# EAGLE design Baro_V3 (EAGLE 9.6.2)
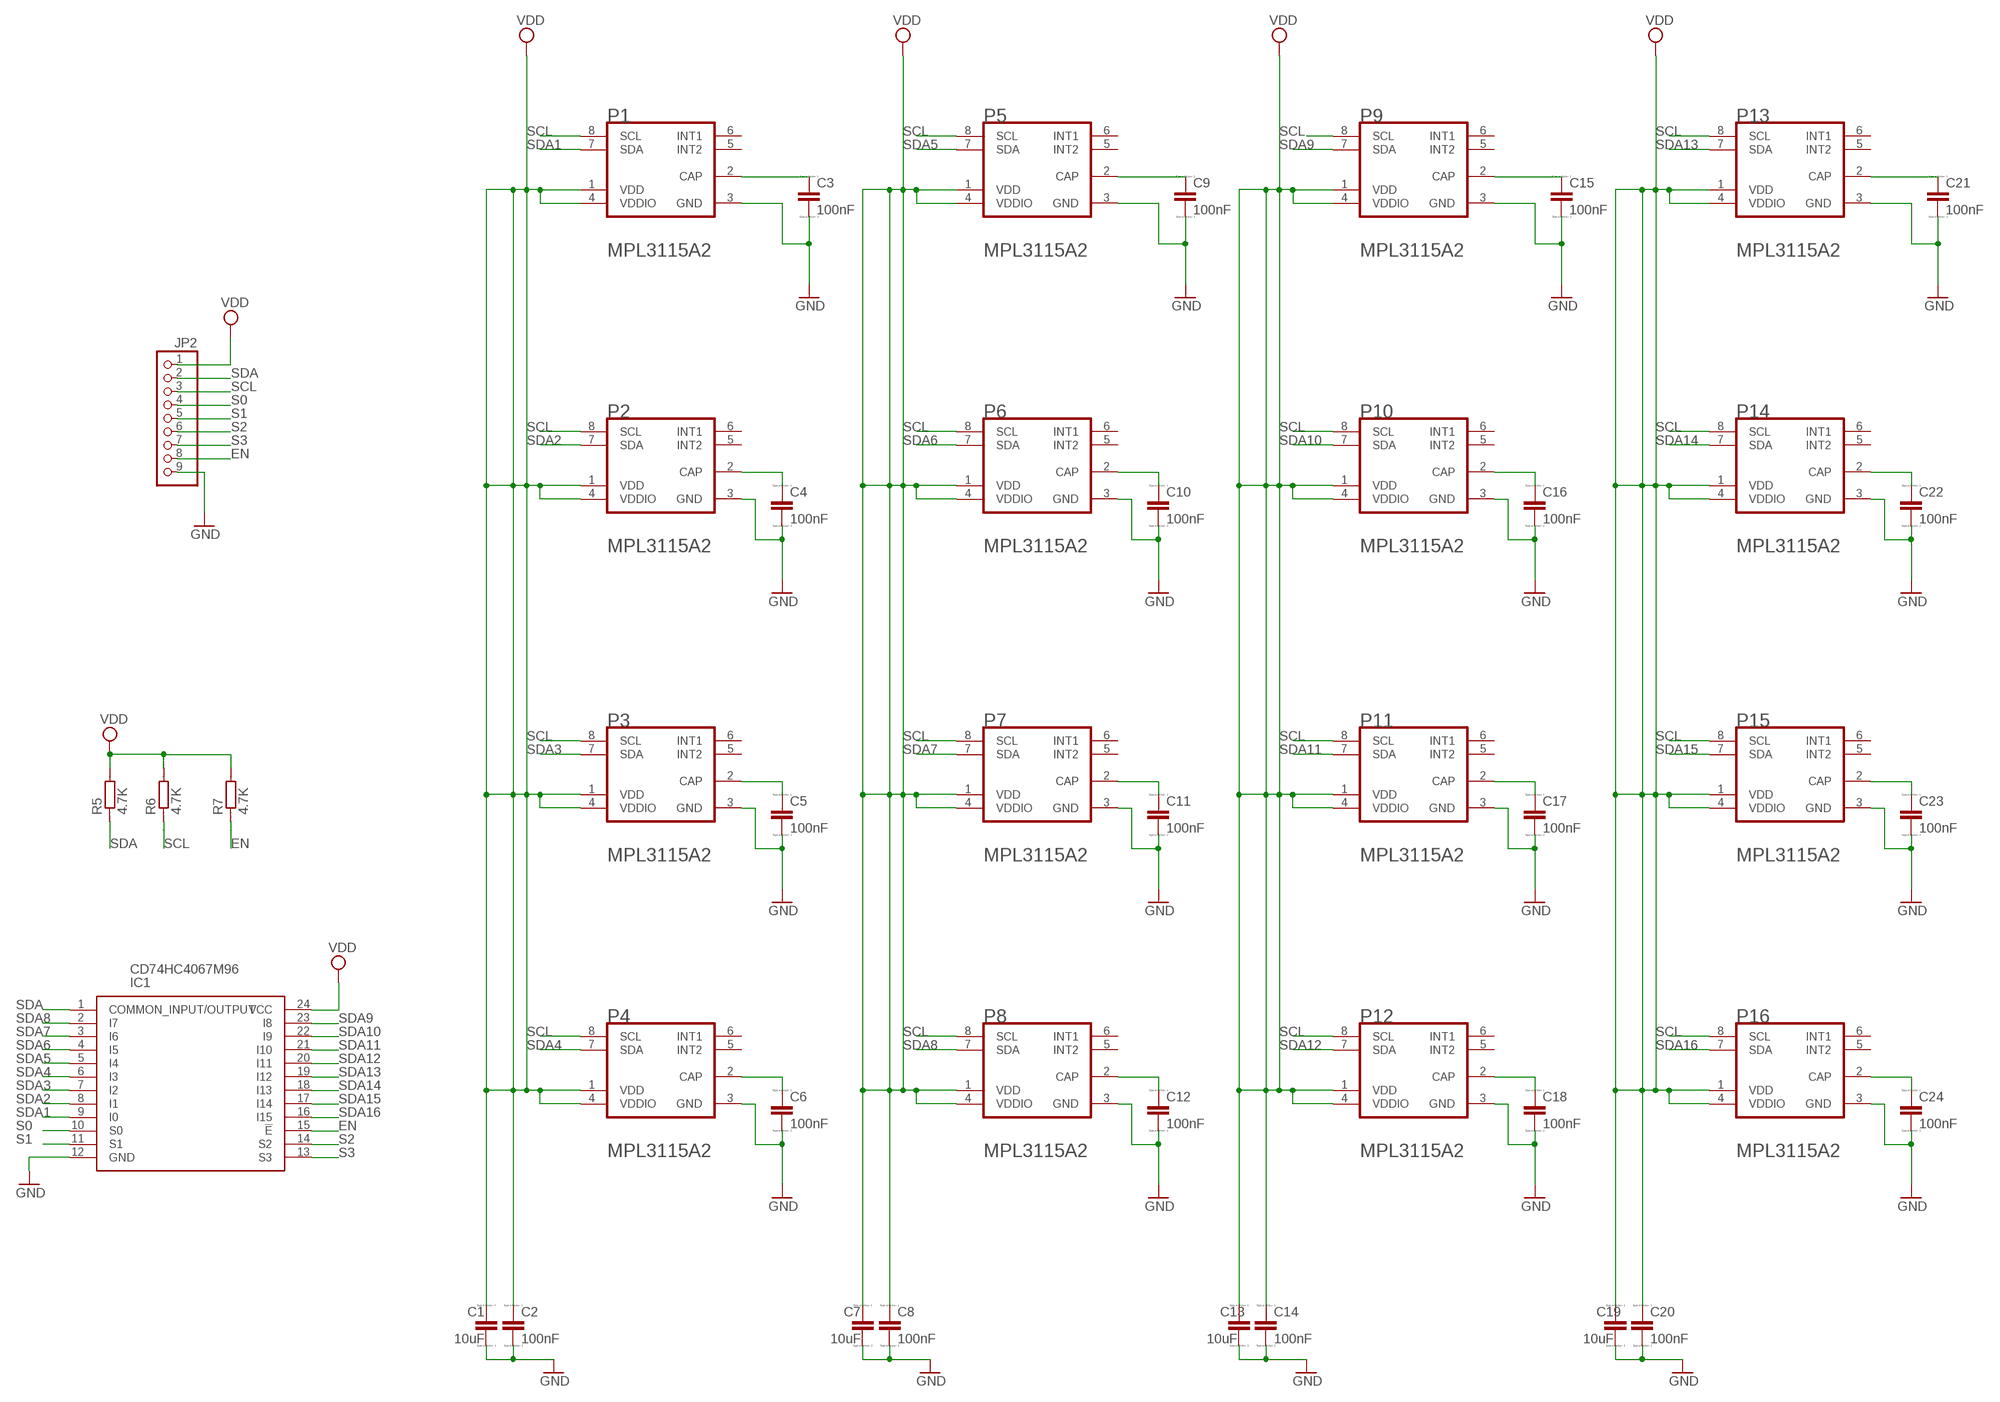
[diagram p0: schematic, sheet 1]

## Parts
C1  10uF  CC0603  [C0603]
C2  100nF  C  [C0805]
C3  100nF  C  [C0805]
C4  100nF  C  [C0805]
C5  100nF  C  [C0805]
C6  100nF  C  [C0805]
C7  10uF  CC0603  [C0603]
C8  100nF  C  [C0805]
C9  100nF  C  [C0805]
C10  100nF  C  [C0805]
C11  100nF  C  [C0805]
C12  100nF  C  [C0805]
C13  10uF  CC0603  [C0603]
C14  100nF  C  [C0805]
C15  100nF  C  [C0805]
C16  100nF  C  [C0805]
C17  100nF  C  [C0805]
C18  100nF  C  [C0805]
C19  10uF  CC0603  [C0603]
C20  100nF  C  [C0805]
C21  100nF  C  [C0805]
C22  100nF  C  [C0805]
C23  100nF  C  [C0805]
C24  100nF  C  [C0805]
IC1  CD74HC4067M96  [SOIC127P1030X265-24N]
JP2  PINHD-1X9  [1X09]
P1  FREESCALE_SEMICONDUCTOR_MPL3115A2FREESCALE_SEMICONDUCTOR_MPL3115A2_0_0  [FREESCALE_SEMICONDUCTOR_MPL3115A2_0]
P2  FREESCALE_SEMICONDUCTOR_MPL3115A2FREESCALE_SEMICONDUCTOR_MPL3115A2_0_0  [FREESCALE_SEMICONDUCTOR_MPL3115A2_0]
P3  FREESCALE_SEMICONDUCTOR_MPL3115A2FREESCALE_SEMICONDUCTOR_MPL3115A2_0_0  [FREESCALE_SEMICONDUCTOR_MPL3115A2_0]
P4  FREESCALE_SEMICONDUCTOR_MPL3115A2FREESCALE_SEMICONDUCTOR_MPL3115A2_0_0  [FREESCALE_SEMICONDUCTOR_MPL3115A2_0]
P5  FREESCALE_SEMICONDUCTOR_MPL3115A2FREESCALE_SEMICONDUCTOR_MPL3115A2_0_0  [FREESCALE_SEMICONDUCTOR_MPL3115A2_0]
P6  FREESCALE_SEMICONDUCTOR_MPL3115A2FREESCALE_SEMICONDUCTOR_MPL3115A2_0_0  [FREESCALE_SEMICONDUCTOR_MPL3115A2_0]
P7  FREESCALE_SEMICONDUCTOR_MPL3115A2FREESCALE_SEMICONDUCTOR_MPL3115A2_0_0  [FREESCALE_SEMICONDUCTOR_MPL3115A2_0]
P8  FREESCALE_SEMICONDUCTOR_MPL3115A2FREESCALE_SEMICONDUCTOR_MPL3115A2_0_0  [FREESCALE_SEMICONDUCTOR_MPL3115A2_0]
P9  FREESCALE_SEMICONDUCTOR_MPL3115A2FREESCALE_SEMICONDUCTOR_MPL3115A2_0_0  [FREESCALE_SEMICONDUCTOR_MPL3115A2_0]
P10  FREESCALE_SEMICONDUCTOR_MPL3115A2FREESCALE_SEMICONDUCTOR_MPL3115A2_0_0  [FREESCALE_SEMICONDUCTOR_MPL3115A2_0]
P11  FREESCALE_SEMICONDUCTOR_MPL3115A2FREESCALE_SEMICONDUCTOR_MPL3115A2_0_0  [FREESCALE_SEMICONDUCTOR_MPL3115A2_0]
P12  FREESCALE_SEMICONDUCTOR_MPL3115A2FREESCALE_SEMICONDUCTOR_MPL3115A2_0_0  [FREESCALE_SEMICONDUCTOR_MPL3115A2_0]
P13  FREESCALE_SEMICONDUCTOR_MPL3115A2FREESCALE_SEMICONDUCTOR_MPL3115A2_0_0  [FREESCALE_SEMICONDUCTOR_MPL3115A2_0]
P14  FREESCALE_SEMICONDUCTOR_MPL3115A2FREESCALE_SEMICONDUCTOR_MPL3115A2_0_0  [FREESCALE_SEMICONDUCTOR_MPL3115A2_0]
P15  FREESCALE_SEMICONDUCTOR_MPL3115A2FREESCALE_SEMICONDUCTOR_MPL3115A2_0_0  [FREESCALE_SEMICONDUCTOR_MPL3115A2_0]
P16  FREESCALE_SEMICONDUCTOR_MPL3115A2FREESCALE_SEMICONDUCTOR_MPL3115A2_0_0  [FREESCALE_SEMICONDUCTOR_MPL3115A2_0]
R5  4.7K  RR0603  [R0603]
R6  4.7K  RR0603  [R0603]
R7  4.7K  RR0603  [R0603]

## Nets
EN [EN]: IC1.15(!E) JP2.8 R7.1
GND: C1.2 C2.2 C3.2 C4.2 C5.2 C6.2 C7.2 C8.2 C9.2 C10.2 C11.2 C12.2 C13.2 C14.2 C15.2 C16.2 C17.2 C18.2 C19.2 C20.2 C21.2 C22.2 C23.2 C24.2 IC1.12(GND) JP2.9 P1.3(GND) P2.3(GND) P3.3(GND) P4.3(GND) P5.3(GND) P6.3(GND) P7.3(GND) P8.3(GND) P9.3(GND) P10.3(GND) P11.3(GND) P12.3(GND) P13.3(GND) P14.3(GND) P15.3(GND) P16.3(GND)
N$3: C3.1 P1.2(CAP)
N$6: C4.1 P2.2(CAP)
N$7: C9.1 P5.2(CAP)
N$9: C10.1 P6.2(CAP)
N$11: C11.1 P7.2(CAP)
N$13: C12.1 P8.2(CAP)
N$14: C5.1 P3.2(CAP)
N$15: C6.1 P4.2(CAP)
N$21: C15.1 P9.2(CAP)
N$30: C16.1 P10.2(CAP)
N$31: C17.1 P11.2(CAP)
N$32: C18.1 P12.2(CAP)
N$45: C21.1 P13.2(CAP)
N$46: C22.1 P14.2(CAP)
N$47: C23.1 P15.2(CAP)
N$48: C24.1 P16.2(CAP)
S0 [S0]: IC1.10(S0) JP2.4
S1 [S1]: IC1.11(S1) JP2.5
S2 [S2]: IC1.14(S2) JP2.6
S3 [S3]: IC1.13(S3) JP2.7
SCL [SCL]: JP2.3 P1.8(SCL) P2.8(SCL) P3.8(SCL) P4.8(SCL) P5.8(SCL) P6.8(SCL) P7.8(SCL) P8.8(SCL) P9.8(SCL) P10.8(SCL) P11.8(SCL) P12.8(SCL) P13.8(SCL) P14.8(SCL) P15.8(SCL) P16.8(SCL) R6.1
SDA [SDA]: IC1.1(COMMON_INPUT/OUTPUT) JP2.2 R5.1
SDA1: IC1.9(I0) P1.7(SDA)
SDA2: IC1.8(I1) P2.7(SDA)
SDA3: IC1.7(I2) P3.7(SDA)
SDA4: IC1.6(I3) P4.7(SDA)
SDA5: IC1.5(I4) P5.7(SDA)
SDA6: IC1.4(I5) P6.7(SDA)
SDA7: IC1.3(I6) P7.7(SDA)
SDA8: IC1.2(I7) P8.7(SDA)
SDA9: IC1.23(I8) P9.7(SDA)
SDA10: IC1.22(I9) P10.7(SDA)
SDA11: IC1.21(I10) P11.7(SDA)
SDA12: IC1.20(I11) P12.7(SDA)
SDA13: IC1.19(I12) P13.7(SDA)
SDA14: IC1.18(I13) P14.7(SDA)
SDA15: IC1.17(I14) P15.7(SDA)
SDA16: IC1.16(I15) P16.7(SDA)
VDD: C1.1 C2.1 C7.1 C8.1 C13.1 C14.1 C19.1 C20.1 IC1.24(VCC) JP2.1 P1.1(VDD) P1.4(VDDIO) P2.1(VDD) P2.4(VDDIO) P3.1(VDD) P3.4(VDDIO) P4.1(VDD) P4.4(VDDIO) P5.1(VDD) P5.4(VDDIO) P6.1(VDD) P6.4(VDDIO) P7.1(VDD) P7.4(VDDIO) P8.1(VDD) P8.4(VDDIO) P9.1(VDD) P9.4(VDDIO) P10.1(VDD) P10.4(VDDIO) P11.1(VDD) P11.4(VDDIO) P12.1(VDD) P12.4(VDDIO) P13.1(VDD) P13.4(VDDIO) P14.1(VDD) P14.4(VDDIO) P15.1(VDD) P15.4(VDDIO) P16.1(VDD) P16.4(VDDIO) R5.2 R6.2 R7.2
Unconnected: P1.5(INT2) P1.6(INT1) P2.5(INT2) P2.6(INT1) P3.5(INT2) P3.6(INT1) P4.5(INT2) P4.6(INT1) P5.5(INT2) P5.6(INT1) P6.5(INT2) P6.6(INT1) P7.5(INT2) P7.6(INT1) P8.5(INT2) P8.6(INT1) P9.5(INT2) P9.6(INT1) P10.5(INT2) P10.6(INT1) P11.5(INT2) P11.6(INT1) P12.5(INT2) P12.6(INT1) P13.5(INT2) P13.6(INT1) P14.5(INT2) P14.6(INT1) P15.5(INT2) P15.6(INT1) P16.5(INT2) P16.6(INT1)

## Library data of the parts
C1-C24 = eagle-ltspice:C: CAPACITOR, European symbol; SPICEMODEL: NONE; SPICEPREFIX: C
IC1 = CD74HC4067M96:CD74HC4067M96: High Speed CMOS 16-Channel Analog Multiplexer/Demultiplexer Source: Datasheet <http://www.ti.com/lit/gpn/cd74hc4067>; DESCRIPTION: High Speed CMOS 16-Channel Analog Multiplexer/Demultiplexer; HEIGHT: 2.65mm; MANUFACTURER_NAME: Texas Instruments; MANUFACTURER_PART_NUMBER: CD74HC4067M96; MOUSER_PART_NUMBER: 595-CD74HC4067M96; MOUSER_PRICE-STOCK: https://www.mouser.co.uk/ProductDetail/Texas-Instruments/CD74HC4067M96?qs=xFfolx0DHx0XT7d9xTTZBA%3D%3D
JP2 = pinhead:PINHD-1X9: PIN HEADER
P1-P16 = Freescale Semiconductor - MPL3115A2:FREESCALE_SEMICONDUCTOR_MPL3115A2: FRES-MPL3115A2-8; CIIVA_IDS: 1172243; COMPONENT_LINK_1_DESCRIPTION: Manufacturer URL; COMPONENT_LINK_1_URL: http://www.freescale.com/; COMPONENT_LINK_3_DESCRIPTION: Package Specification; COMPONENT_LINK_3_URL: http://cache.freescale.com/files/shared/doc/package_info/98ASA00260D.pdf; DATASHEET: http://cache.freescale.com/files/sensors/doc/data_sheet/MPL3115A2.pdf; DATASHEET_VERSION: Rev. 3.0; FOOTPRINT_VARIANT_NAME_0: Manufacturer Recommended; FSCL20_PF: 4 MHz Max.; FSCL400_PF: 400 KHz Max.; IMPORTED: yes; IMPORTED_FROM: vault; IMPORT_TS: 1521845373; MF: Freescale Semiconductor; MOUNTING_TECHNOLOGY: Surface Mount; MPN: MPL3115A2; OPERATING_TEMPERATURE_RANGE: -40 to 85 degC; PACKAGE_DESCRIPTION: 8-Pin Land Grid Array, Body 5 x 3 mm, Pitch 1.25 mm; PACKAGE_VERSION: Rev. O; PACKING: Tray; PIN_0_0_7_INSIDE_EDGE: clock; PREFIX: U; RELEASE_DATE: 1435138815; ROHS: Yes; VAULT_GUID: C9CA789F-172F-4FBE-A7EA-5C936E43DE32; VAULT_REVISION: 13F1D4E8-B129-4F1C-B772-6A98733F3276; VDD: 1.95 to 3.6 V; VDDIO: 1.62 to 3.6 V
R5-R7 = eagle-ltspice:R: RESISTOR, European symbol; SPICEMODEL: NONE; SPICEPREFIX: R

## Board
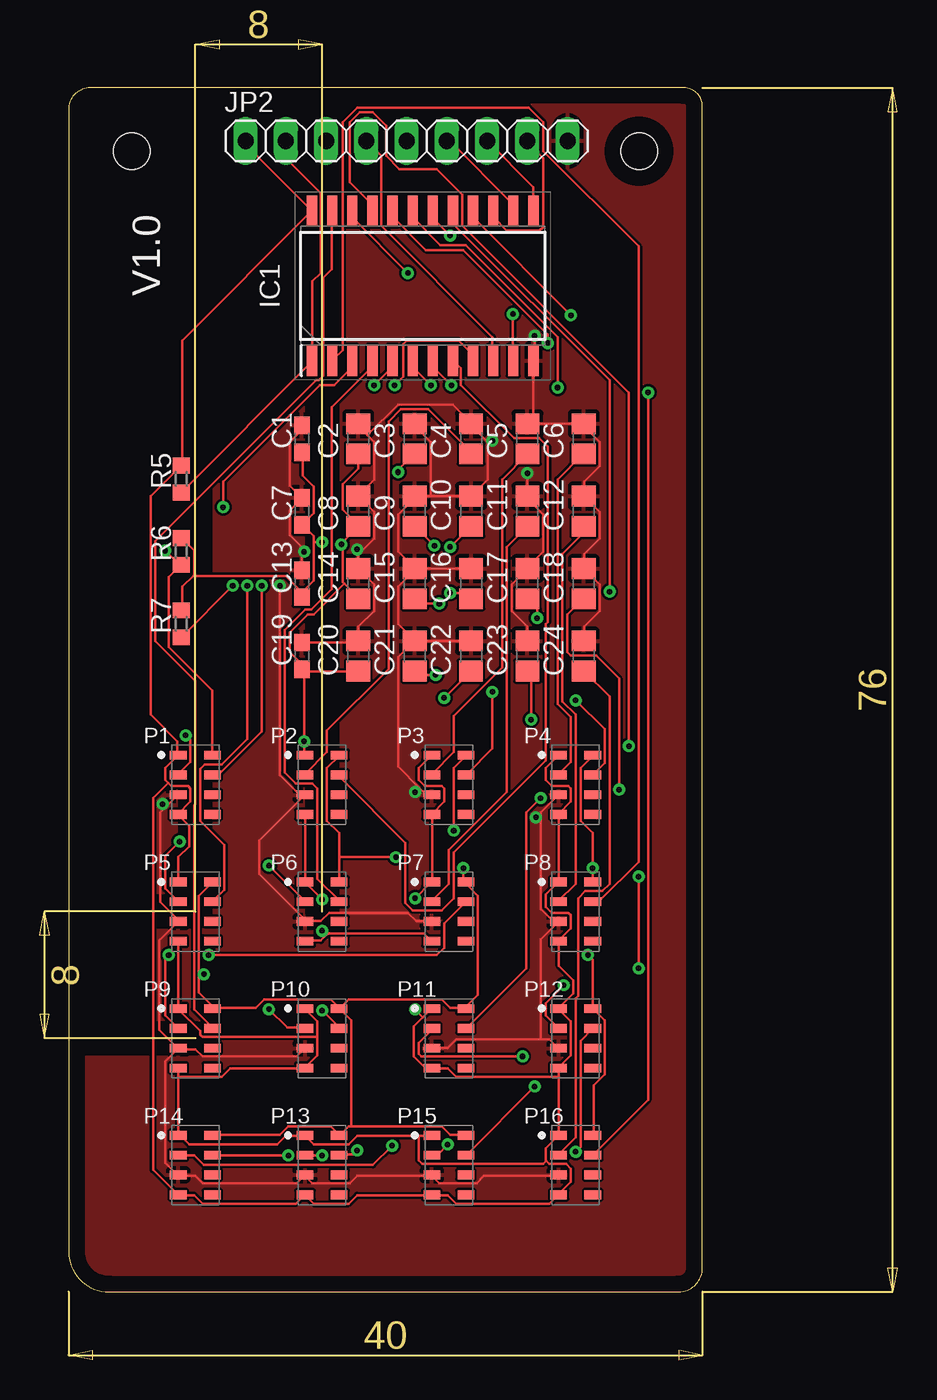
[diagram p1: board, top side]
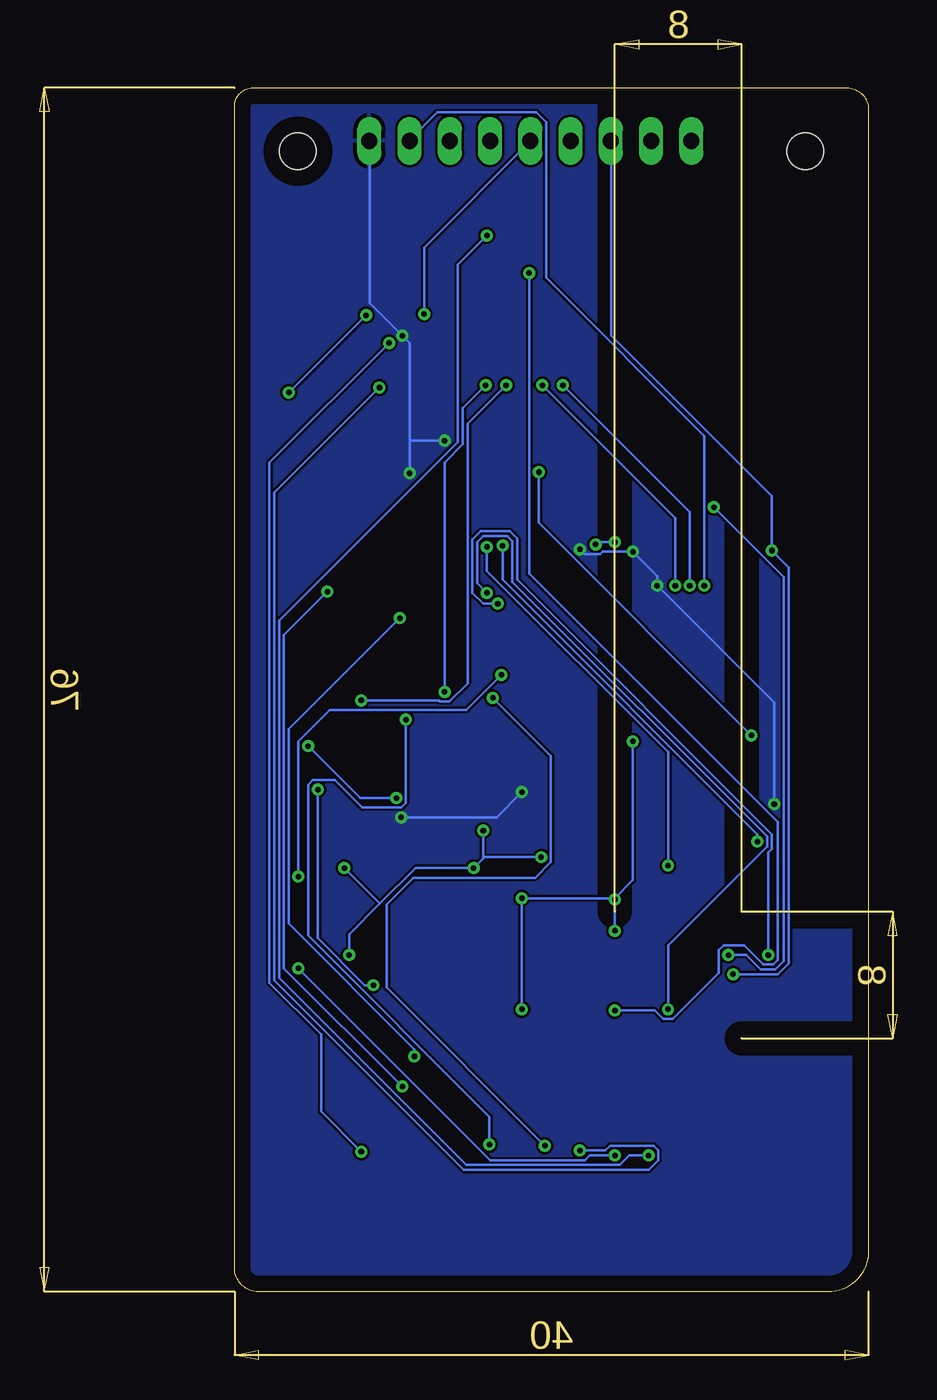
[diagram p2: board, bottom side, seen from below]

Size 40 x 76 mm. Coordinates in mm from the lower left corner, seen from the top.
Outline: 0,74.62 0,2.54 arc90 2.54,0 38.5,0 arc90 40,1.5 40,74.83 arc90 38.84,76 1.38,76 arc90 0,74.62
Copper layers (1*16): Top 0.035mm / dielectric 1.5mm / Bottom 0.035mm
Design rules "default": minimum track width 6mil, minimum drill 0.35mm, track to track 6mil, track to pad 6mil, pad to pad 6mil, via to via 6mil, smd to smd 6mil, copper to edge 40mil, drill to drill 6mil, minimum pad ring 10mil, minimum via ring 8mil, stop-mask expansion 4mil, vias tented up to drill 0mil, thermal gap 10mil
Holes 2.3 mm at 36,72 4,72

### Footprints (pad centres in the part's own frame; a part is rotated, then mirrored left to right if it is on the bottom)
C0603 = smd 1.1 x 1: 1 -0.85,0; 2 0.85,0
C0805 = smd 1.3 x 1.5: 1 -0.95,0; 2 0.95,0
SOIC127P1030X265-24N = smd 1.95 x 0.65: 1 -4.725,6.985; 2 -4.725,5.715; 3 -4.725,4.445; 4 -4.725,3.175; 5 -4.725,1.905; 6 -4.725,0.635; 7 -4.725,-0.635; 8 -4.725,-1.905; 9 -4.725,-3.175; 10 -4.725,-4.445; 11 -4.725,-5.715; 12 -4.725,-6.985; 13 4.725,-6.985; 14 4.725,-5.715; 15 4.725,-4.445; 16 4.725,-3.175; 17 4.725,-1.905; 18 4.725,-0.635; 19 4.725,0.635; 20 4.725,1.905; 21 4.725,3.175; 22 4.725,4.445; 23 4.725,5.715; 24 4.725,6.985
1X09 = drill 1.016 long: 1 -10.16,0; 2 -7.62,0; 3 -5.08,0; 4 -2.54,0; 5 0,0; 6 2.54,0; 7 5.08,0; 8 7.62,0; 9 10.16,0
FREESCALE_SEMICONDUCTOR_MPL3115A2_0 = smd 1.05 x 0.55: 1 -1.075,1.875; 2 -1.075,0.625; 3 -1.075,-0.625; 4 -1.075,-1.875; 5 1.075,-1.875; 6 1.075,-0.625; 7 1.075,0.625; 8 1.075,1.875
R0603 = smd 1 x 1.1: 1 -0.85,0; 2 0.85,0

### Placement (x,y rotation side)
C1  14.73,53.85 90 top
C2  18.29,53.85 90 top
C3  21.84,53.85 90 top
C4  25.4,53.85 90 top
C5  28.96,53.85 90 top
C6  32.51,53.85 90 top
C7  14.73,49.28 90 top
C8  18.29,49.28 90 top
C9  21.84,49.28 90 top
C10  25.4,49.28 90 top
C11  28.96,49.28 90 top
C12  32.51,49.28 90 top
C13  14.73,44.7 90 top
C14  18.29,44.7 90 top
C15  21.84,44.7 90 top
C16  25.4,44.7 90 top
C17  28.96,44.7 90 top
C18  32.51,44.7 90 top
C19  14.73,40.13 90 top
C20  18.29,40.13 90 top
C21  21.84,40.13 90 top
C22  25.4,40.13 90 top
C23  28.96,40.13 90 top
C24  32.51,40.13 90 top
IC1  22.35,63.5 90 top
JP2  21.34,72.64 0 top
P1  8,32 0 top
P2  16,32 0 top
P3  24,32 0 top
P4  32,32 0 top
P5  8,24 0 top
P6  16,24 0 top
P7  24,24 0 top
P8  32,24 0 top
P9  8,16 0 top
P10  16,16 0 top
P11  24,16 0 top
P12  32,16 0 top
P13  16,8 0 top
P14  8,8 0 top
P15  24,8 0 top
P16  32,8 0 top
R5  7.11,51.31 90 top
R6  7.11,46.74 90 top
R7  7.11,42.16 90 top

### Tracks (layer width: path | path; a pad name or v marks a point on that pad's centre or on a via)
EN  (via drill 0.35)
  Top 0.152: v10.36,44.58 7.16,41.38 R7.1 | JP2.8 28.96,72.54 29.95,71.55 29.95,67.21 29.72,66.98 27.66,66.98 26.82,67.82 26.82,68.2 IC1.15
  Bottom 0.152: v10.36,44.58 10.36,54.03 20.34,64.01 20.34,73.84 20.95,74.45 27.2,74.45 28.96,72.69 JP2.8
GND  (via drill 0.35)
  Top 0.152: 6.13,30.59 6.86,31.32 P1.3 | 6.13,30.59 5.79,30.25 5.79,24.61 6.86,23.55 6.86,23.39 P5.3 6.86,23.32 5.71,22.17 5.71,16.54 6.86,15.39 P9.3 | P9.3 6.93,15.32 8,15.32 8.46,14.86 14.4,14.86 14.86,15.32 P10.3 | P16.3 30.86,7.32 26.21,7.32 25.76,6.86 23.39,6.86 22.94,7.32 P15.3 22.86,7.32 18.21,7.32 17.75,6.86 15.39,6.86 14.94,7.32 P13.3 14.86,7.32 14.4,6.86 8.46,6.86 8,7.32 6.93,7.32 P14.3 6.86,7.39 6.1,8.15 6.1,14.55 6.86,15.32 P9.3 | P7.3 22.86,23.39 21.95,23.39 21.41,23.93 16.46,23.93 15.93,23.39 14.94,23.39 P6.3 14.94,23.47 12.04,26.36 12.04,28.5 14.86,31.32 P2.3 14.71,31.24 13.34,32.61 v13.34,44.58 | 14.71,46.71 14.71,47.02 13.95,47.78 13.95,49.3 14.71,50.06 C7.2 14.71,50.14 13.95,50.9 13.95,53.65 14.71,54.41 14.71,54.63 C1.2 | 14.71,46.71 14.71,45.57 C13.2 | C19.2 14.78,41 18.21,41 C20.2 18.29,41.99 19.28,42.98 19.28,44.65 C14.2 18.29,46.56 18.4,46.67 | 18.4,46.67 19.28,47.55 19.28,49.23 18.29,50.22 C8.2 18.29,50.29 19.28,51.28 19.28,53.65 18.86,54.06 | C2.2 18.29,54.63 18.86,54.06 | v14.86,46.71 14.71,46.71 | 18.4,46.67 v18.21,46.86 | C23.2 28.96,41.99 27.96,42.98 27.96,44.65 C17.2 28.96,45.72 29.95,46.71 29.95,49.07 28.96,50.06 C11.2 v28.96,51.66 | C24.2 32.54,41.15 32.54,41.99 33.53,42.98 33.53,44.65 32.54,45.64 C18.2 32.54,45.72 32.54,46.56 33.53,47.55 33.53,49.23 32.54,50.22 C12.2 32.54,50.29 32.54,51.13 33.53,52.12 33.53,53.65 32.46,54.71 C6.2 32.46,54.79 29.34,54.79 | 29.34,54.79 28.96,54.79 C5.2 29.34,54.79 | 29.34,54.79 IC1.12 29.34,58.83 29.41,58.9 v29.41,60.35 | 29.79,15.93 30.33,15.93 30.86,15.39 P12.3 | 29.79,15.93 24.46,15.93 23.93,15.39 22.94,15.39 P11.3
  Top 0.152: 29.79,15.93 29.79,22.25 30.86,23.32 P8.3 30.71,23.24 29.79,24.16 29.79,29.95 | 29.79,29.95 29.79,30.25 30.86,31.32 P4.3 | 22.86,50.22 25.38,50.22 C10.2 25.45,50.29 26.44,51.28 26.44,53.65 26.4,53.68 | 22.86,50.22 21.87,50.22 C9.2 21.87,50.14 20.8,49.07 20.8,46.71 21.79,45.72 C15.2 | 22.86,50.22 22.86,53.65 21.87,54.63 21.87,54.79 C3.2 | 26.4,53.68 25.45,54.63 25.45,54.79 C4.2 25.38,54.86 24.23,56.01 20.8,56.01 18.86,54.06 | C15.2 21.87,45.64 25.38,45.64 C16.2 | 22.14,31.81 20.8,33.15 20.8,40.08 21.79,41.07 C21.2 | 22.14,31.81 22.55,31.39 22.86,31.39 P3.3 | C22.2 25.38,41.07 21.87,41.07 C21.2 | C15.2 21.87,45.57 20.8,44.5 20.8,42.14 21.79,41.15 C21.2 | v29.49,29.95 29.79,29.95 | 22.14,31.81 v21.87,31.55 | v26.75,53.72 26.44,53.72 26.4,53.68 | v5.94,30.79 6.13,30.59
  Bottom 0.152: v18.21,46.86 17.91,46.56 16.92,46.56 16.76,46.71 v14.86,46.71 13.34,45.19 v13.34,44.58 5.94,37.19 v5.94,30.79 | JP2.9 31.47,72.62 31.47,62.41 v29.41,60.35 28.96,59.89 28.96,53.72 | 28.96,53.72 v28.96,51.66 | v29.49,29.95 23.47,29.95 v21.87,31.55 | v26.75,53.72 28.96,53.72
  pour Bottom: 0,75.18 1.02,76.2 39.12,76.2 40.13,75.18 40.13,73.15 40.13,1.02 39.12,0 1.52,0 1.02,0 0,1.02
  pour Top: 0,75.18 1.02,76.2 39.62,76.2 40.13,75.69 40.13,71.12 40.13,1.02 39.12,0 1.52,0 0,1.52
N$3  (via drill 0.35)
  Top 0.152: v7.39,35.13 7.7,34.82 7.7,33.45 6.93,32.69 P1.2 | v20.8,51.74 20.8,51.89 21.79,52.88 C3.1
  Bottom 0.152: v7.39,35.13 20.8,48.54 v20.8,51.74
N$6
  Top 0.152: P2.2 14.94,32.69 16.31,34.06 16.31,35.43 20.19,39.32 20.19,54.94 20.95,55.7 22.71,55.7 25.45,52.96 C4.1
N$7  (via drill 0.35)
  Top 0.152: v7.01,28.42 6.1,27.51 6.1,25.45 6.86,24.69 P5.2 | v23.09,47.09 21.87,48.31 C9.1
  Bottom 0.152: v7.01,28.42 7.01,28.88 23.09,44.96 v23.09,47.09
N$9  (via drill 0.35)
  Top 0.152: v12.65,26.9 14.86,24.69 P6.2 | v24.08,47.02 25.38,48.31 C10.1
  Bottom 0.152: v12.65,26.9 12.65,34.06 24.08,45.49 v24.08,47.02
N$11
  Top 0.152: P7.2 22.94,24.69 24,25.76 24,27.89 27.66,31.55 27.66,47.02 28.96,48.31 C11.1
N$13
  Top 0.152: P8.2 30.94,24.69 32,25.76 32,36.42 31.17,37.26 31.17,46.56 32.46,47.85 32.46,48.31 C12.1
N$14
  Top 0.152: P3.2 22.94,32.69 24.31,34.06 24.31,36.35 27.36,39.4 27.36,51.28 28.96,52.88 C5.1
N$15
  Top 0.152: P4.2 30.94,32.69 31.7,33.45 31.7,36.27 30.86,37.11 30.86,51.28 32.46,52.88 C6.1
N$21  (via drill 0.35)
  Top 0.152: v6.33,21.26 6.1,21.03 6.1,17.45 6.86,16.69 P9.2 | v23.39,43.43 22.17,43.43 21.87,43.74 C15.1
  Bottom 0.152: v6.33,21.26 6.33,27.74 6.1,27.96 6.1,28.88 22.17,44.96 22.17,47.55 22.63,48.01 24.46,48.01 24.99,47.47 24.99,44.12 24.31,43.43 v23.39,43.43
N$30  (via drill 0.35)
  Top 0.152: v12.65,17.83 13.79,16.69 14.86,16.69 P10.2 | v24.08,44.12 25.07,44.12 25.38,43.81 C16.1
  Bottom 0.152: v12.65,17.83 12.65,21.87 6.4,28.12 6.4,28.73 22.48,44.81 22.48,47.4 22.78,47.7 24.31,47.7 24.69,47.32 24.69,44.73 v24.08,44.12
N$31  (via drill 0.35)
  Top 0.152: v28.65,14.86 22.25,14.86 22.1,15.01 22.1,15.7 22.86,16.46 22.86,16.61 P11.2 | v29.57,42.52 29.57,43.13 28.96,43.74 C17.1
  Bottom 0.152: v28.65,14.86 28.65,15.32 36.58,23.24 36.58,35.51 v29.57,42.52
N$32  (via drill 0.35)
  Top 0.152: v31.24,19.36 30.1,18.21 30.1,17.45 30.86,16.69 P12.2 | v34.75,31.7 34.75,38.71 33.3,40.16 31.7,40.16 31.47,40.39 31.47,42.75 32.46,43.74 C18.1
  Bottom 0.152: v31.24,19.36 31.77,19.36 34.75,22.33 v34.75,31.7
N$45  (via drill 0.35)
  Top 0.152: v16,8.61 P13.2 | v35.97,26.21 v35.97,20.42 | v23.16,38.94 22.1,38.94 21.87,39.17 C21.1
  Bottom 0.152: v16,8.61 17.6,8.61 17.91,8.31 23.85,8.31 v35.97,20.42 | v35.97,26.21 35.97,34.75 33.98,36.73 25.38,36.73 v23.16,38.94
N$46  (via drill 0.35)
  Top 0.152: v20.42,9.22 19.2,8 8.53,8 7.92,8.61 6.93,8.61 P14.2 | v23.7,37.49 25.38,39.17 C22.1
  Bottom 0.152: v20.42,9.22 30.4,19.2 30.4,24.46 28.73,26.14 21.03,26.14 20.04,27.13 20.04,33.83 v23.7,37.49
N$47  (via drill 0.35)
  Top 0.152: v23.93,9.3 23.32,8.69 22.94,8.69 P15.2 | v29.18,36.12 29.18,38.94 28.96,39.17 C23.1
  Bottom 0.152: v23.93,9.3 23.93,11.05 35.36,22.48 35.36,32 35.05,32.31 33.68,32.31 31.93,30.56 29.49,30.56 29.18,30.86 v29.18,36.12
N$48
  Top 0.152: P16.2 30.94,8.69 32,9.75 32,18.52 32.16,18.67 32.16,24.84 32.61,25.3 33.68,25.3 34.14,25.76 34.14,37.57 32.54,39.17 C24.1
S0
  Top 0.152: JP2.4 19.74,71.7 19.74,67.28 26.75,60.27 26.75,58.83 IC1.10
S1  (via drill 0.35)
  Top 0.152: v28.04,61.72 28.04,58.83 IC1.11
  Bottom 0.152: v28.04,61.72 28.04,65.91 21.34,72.62 JP2.5
S2
  Top 0.152: IC1.14 28.04,68.28 28.04,68.66 24.08,72.62 23.93,72.62 JP2.6
S3
  Top 0.152: IC1.13 29.34,69.72 JP2.7
SCL  (via drill 0.35)
  Top 0.152: P14.8 9.14,9.91 13.34,9.91 13.87,10.44 16.54,10.44 17.07,9.91 P13.8 17.14,9.91 17.68,10.44 17.83,10.44 | 17.83,10.44 23.55,10.44 24.08,9.91 25.07,9.91 P15.8 | 17.07,27.43 17.07,28.96 16.31,29.72 16.31,33.07 17.07,33.83 P2.8 | 17.07,27.43 17.07,25.91 P6.8 | P8.8 33.07,25.91 v33.07,26.75 33.07,28.96 32.31,29.72 32.31,33.07 33.07,33.83 P4.8 | P16.8 33.15,9.91 33.15,13.03 33.83,13.72 33.83,17.14 33.15,17.83 P12.8 33.07,17.91 33.07,20.95 v32.77,21.26 | P10.8 17.07,17.91 16.54,18.44 12.34,18.44 11.81,17.91 9.14,17.91 P9.8 9.14,17.98 8.23,18.9 8.23,20.04 | 8.23,20.04 8.23,24.99 9.07,25.83 P5.8 | P10.8 17.14,17.91 17.68,18.44 23.55,18.44 24.08,17.91 25.07,17.91 P11.8 25.07,17.98 25.83,18.75 25.83,24.99 25.15,25.68 25.15,25.83 P7.8 25.07,25.91 24.92,26.06 v24.92,26.75 | v24.31,29.11 24.31,33.07 25.07,33.83 P3.8 | v20.65,27.43 17.07,27.43 | 17.83,10.44 17.83,17.14 17.14,17.83 P10.8 | P1.8 9.07,33.91 9.07,37.95 6.33,40.69 6.33,45.11 7.09,45.87 R6.1 7.01,45.87 v6.1,46.79 | v8.53,20.04 8.23,20.04
  Bottom 0.152: 24.31,27.43 24.31,27.36 v24.92,26.75 28.57,26.75 30.82,24.5 | 24.31,27.43 v24.31,29.11 | v32.77,21.26 32.77,22.55 30.82,24.5 | 30.82,24.5 v33.07,26.75 | 24.31,27.43 v20.65,27.43 | JP2.3 16.23,72.62 16.23,60.35 6.1,50.22 v6.1,46.79 5.03,45.72 5.03,20.73 5.71,20.04 v8.53,20.04
SDA
  Top 0.152: R5.1 7.16,50.52 15.39,58.75 IC1.1 15.39,58.83 15.39,63.78 15.93,64.31 15.93,69.34 13.72,71.55 JP2.2
SDA1  (via drill 0.35)
  Top 0.152: v12.19,44.58 12.19,35.36 9.53,32.69 9.14,32.69 P1.7 | v20.57,57.23 21.11,57.76 21.11,59.82 21.34,60.05 24.61,60.05 25.53,59.13 IC1.9
  Bottom 0.152: v12.19,44.58 12.19,48.84 v20.57,57.23
SDA2
  Top 0.152: P2.7 17.14,32.61 17.14,32.46 21.26,28.35 21.26,24.54 21.72,24.08 23.55,24.08 24.31,24.84 24.31,27.74 30.1,33.53 30.1,42.14 30.25,42.29 30.25,53.34 29.72,53.87 28.12,53.87 24.77,57.23 24.77,58.29 24.31,58.75 IC1.8
SDA3  (via drill 0.35)
  Top 0.152: v26.75,37.87 26.75,34.29 25.15,32.69 P3.7 | v24.16,57.23 23.01,58.37 23.01,58.75 IC1.7
  Bottom 0.152: v26.75,37.87 26.75,52.35 25.6,53.49 25.6,55.78 v24.16,57.23
SDA4  (via drill 0.35)
  Top 0.152: v32,37.34 33.83,35.51 33.83,33.38 33.15,32.69 P4.7 | v22.86,57.23 21.72,58.37 IC1.6
  Bottom 0.152: v32,37.34 27.13,37.34 27.05,37.26 26.44,37.26 25.3,38.41 25.3,54.79 v22.86,57.23
SDA5  (via drill 0.35)
  Top 0.152: v11.28,44.58 11.28,34.9 9.68,33.3 8.61,33.3 8.31,32.99 8.31,29.72 9.83,28.19 9.83,25.38 9.14,24.69 P5.7 | v19.28,57.23 20.42,58.37 20.42,58.75 IC1.5
  Bottom 0.152: v11.28,44.58 11.28,49.23 v19.28,57.23
SDA6
  Top 0.152: P6.7 17.07,24.69 15.7,26.06 15.7,31.77 15.39,32.08 14.33,32.08 13.64,32.77 13.64,41.76 14.94,43.05 15.32,43.05 16.61,44.35 16.61,55.85 19.13,58.37 19.13,58.75 IC1.4
SDA7  (via drill 0.35)
  Top 0.152: v8.84,21.26 23.24,21.26 23.7,21.72 23.7,23.24 P7.7 | v9.75,49.53 9.75,51.13 15.85,57.23 16.76,57.23 17.91,58.37 IC1.3
  Bottom 0.152: v8.84,21.26 7.7,21.26 6.78,20.34 5.87,20.34 5.33,20.88 5.33,45.11 v9.75,49.53
SDA8
  Top 0.152: P8.7 33.15,24.69 33.53,24.69 35.97,27.13 35.97,65.99 29.95,72.01 29.95,73.84 29.03,74.75 18.21,74.75 17.3,73.84 17.3,59.44 16.69,58.83 IC1.2
SDA9
  Top 0.152: P9.7 9.07,16.69 7.92,17.83 7.92,30.71 8,30.79 8,38.56 5.49,41.07 5.49,47.4 15.62,57.53 15.77,57.53 16.08,57.84 16.08,64.01 16.61,64.54 16.61,68.2 IC1.23
SDA10  (via drill 0.35)
  Top 0.152: v16,17.75 17.07,16.69 P10.7 | v21.41,64.31 17.91,67.82 IC1.22
  Bottom 0.152: v16,17.75 13.49,17.75 12.95,17.22 12.34,17.22 9.45,20.12 9.45,21.57 9.14,21.87 7.85,21.87 6.63,20.65 6.02,20.65 5.71,20.95 5.71,29.64 21.41,45.34 v21.41,64.31
SDA11  (via drill 0.35)
  Top 0.152: v29.79,31.17 28.88,30.25 28.88,20.42 25.15,16.69 P11.7 | v35.36,34.44 35.36,56.77 24.84,67.28 24.84,69.27 23.24,70.87 20.88,70.87 20.04,71.7 20.04,73.61 19.2,74.45 18.36,74.45 17.75,73.84 17.75,70.03 19.13,68.66 19.13,68.28 IC1.21
  Bottom 0.152: v29.79,31.17 32.08,31.17 v35.36,34.44
SDA12  (via drill 0.35)
  Top 0.152: v32,8.84 32.31,9.14 32.31,15.85 P12.7 | v30.25,59.89 30.25,60.43 24.92,65.76 22.55,65.76 20.5,67.82 20.5,68.2 IC1.20
  Bottom 0.152: v32,8.84 34.54,11.38 34.54,16.26 37.8,19.51 37.8,52.35 v30.25,59.89
SDA13  (via drill 0.35)
  Top 0.152: v18.21,8.91 17.98,8.69 17.14,8.69 P13.7 | v30.86,57.07 30.86,60.27 25.07,66.06 23.47,66.06 21.72,67.82 IC1.19
  Bottom 0.152: v18.21,8.91 16.61,8.91 16.31,9.22 13.56,9.22 13.26,8.91 13.26,8.31 13.87,7.7 25.53,7.7 37.49,19.66 37.49,50.44 v30.86,57.07
SDA14  (via drill 0.35)
  Top 0.152: v13.87,8.61 9.14,8.61 P14.7 | v24.08,66.67 23.01,67.74 23.01,68.2 IC1.18
  Bottom 0.152: v13.87,8.61 15.09,8.61 15.7,8 25.38,8 37.19,19.81 37.19,42.37 25.91,53.65 25.91,64.85 v24.08,66.67
SDA15  (via drill 0.35)
  Top 0.152: v29.41,12.95 25.15,8.69 P15.7 | v34.14,44.2 34.14,57.53 24.31,67.36 24.31,68.2 IC1.17
  Bottom 0.152: v29.41,12.95 36.88,20.42 36.88,41.45 v34.14,44.2
SDA16  (via drill 0.35)
  Top 0.152: v36.58,56.77 36.58,12.12 33.15,8.69 P16.7 | v31.7,61.65 25.53,67.82 IC1.16
  Bottom 0.152: v31.7,61.65 v36.58,56.77
VDD  (via drill 0.35)
  Top 0.152: P5.1 6.93,25.91 6.93,27.43 7.62,28.12 7.62,29.41 6.93,30.1 P1.4 6.93,30.18 7.7,30.94 7.7,31.77 7.54,31.93 6.48,31.93 6.29,32.12 | 6.29,32.12 6.1,32.31 6.1,33.07 6.86,33.83 P1.1 6.86,33.91 6.86,34.75 5.18,36.42 5.18,50.22 7.09,52.12 R5.2 7.16,52.2 7.16,60.05 15.32,68.2 IC1.24 15.32,68.28 11.2,72.39 11.2,72.62 JP2.1 | 7.89,45.23 7.92,45.26 7.92,46.79 7.16,47.55 R6.2 | 7.89,45.23 7.16,44.5 7.16,43.05 R7.2 | 14.78,44.12 14.78,44.2 15.47,44.88 15.47,47.32 | 14.78,44.12 14.78,43.89 C13.1 14.78,44.12 | 15.47,47.32 15.47,47.7 14.78,48.39 C7.1 14.78,48.46 15.47,49.15 15.47,50.83 14.78,51.51 14.78,52.96 C1.1 | 14.78,44.12 13.72,45.19 7.92,45.19 7.89,45.23 | 14.86,39.17 v14.86,34.75 14.86,33.91 P2.1 | 14.86,39.17 14.78,39.24 C19.1 | 14.86,39.17 18.29,39.17 C20.1 | 14.86,39.17 C19.1 | 17.41,44.69 17.3,44.81 17.3,47.17 | 17.41,44.69 18.29,43.81 C14.1 | 17.3,47.17 17.3,47.32 18.29,48.31 C8.1 18.29,48.39 17.3,49.38 17.3,50.98 18.29,51.97 C2.1 | 17.41,44.69 15.47,42.75 15.09,42.75 13.95,41.6 13.95,40.39 14.71,39.62 14.71,39.32 C19.1 | v16,47.32 15.47,47.32 | 17.3,47.17 v17.22,47.17 | P5.4 6.93,22.1 6.93,17.91 P9.1 6.93,17.83 8.31,16.46 8.31,16.23 8.46,16.08 15.7,16.08 | 15.7,16.08 15.7,17.07 14.94,17.83 P10.1 | 15.7,16.08 15.7,14.94 14.94,14.17 P10.4 14.86,14.1 10.21,14.1 9.68,13.56 6.93,13.56 | 6.93,13.56 6.93,14.1 P9.4 | 6.93,13.56 6.93,9.91 P14.1 7.01,9.91 7.62,9.3 13.18,9.3 13.72,9.83 14.86,9.83 P13.1 14.94,9.83 15.47,9.3 17.68,9.3 18.21,9.83 22.1,9.83 | 22.1,9.83 22.86,9.83 P15.1 | P3.1 22.86,33.83 22.1,33.07 22.1,32.31 22.48,31.93 23.55,31.93 23.7,31.77 23.7,30.94 22.94,30.18 P3.4 22.94,30.1 22.94,25.91 P7.1 22.86,25.83 v21.87,24.84
  Top 0.152: P2.4 14.94,30.1 14.94,25.91 P6.1 14.94,25.83 v16,24.77 | 16.27,22.52 16.38,22.63 22.4,22.63 22.86,22.17 P7.4 | 16.27,22.52 15.93,22.17 14.94,22.17 P6.4 | 16.27,22.52 v16,22.78 | P4.1 30.86,33.83 30.1,33.07 30.1,32.31 30.48,31.93 31.55,31.93 31.7,31.77 31.7,30.94 30.94,30.18 P4.4 30.94,30.1 30.94,25.91 P8.1 30.86,25.83 30.1,25.07 30.1,24.31 30.48,23.93 31.55,23.93 31.7,23.77 31.7,22.94 30.94,22.17 P8.4 30.94,22.1 30.94,20.57 31.85,19.66 31.85,18.82 30.94,17.91 P12.1 30.94,17.83 31.7,17.07 31.7,14.94 30.94,14.17 P12.4 30.94,14.1 30.94,13.56 | 22.36,17.34 22.86,17.83 P11.1 | 22.36,17.34 21.79,16.76 21.79,14.86 22.48,14.17 22.86,14.17 P11.4 22.94,14.1 23.93,14.1 24.46,13.56 30.94,13.56 | 30.14,8.27 30.1,8.31 30.1,9.07 30.86,9.83 P16.1 30.94,9.91 30.94,13.56 | 30.14,8.27 30.33,8.08 31.39,8.08 31.7,7.77 31.7,6.93 30.94,6.17 P16.4 30.86,6.1 30.33,5.56 24.46,5.56 23.93,6.1 22.94,6.1 P15.4 22.86,6.1 18.21,6.1 17.68,5.56 15.47,5.56 14.94,6.1 P13.4 14.86,6.1 14.33,5.56 8.46,5.56 7.92,6.1 6.93,6.1 P14.4 6.86,6.17 5.33,7.7 5.33,31.17 6.29,32.12 | 22.36,17.34 v21.87,17.83 | 22.1,9.83 22.1,8.31 22.33,8.08 29.95,8.08 30.14,8.27
  Bottom 0.152: v16,47.32 17.07,47.32 v17.22,47.17 | v16,22.78 v16,24.77 | v16,24.77 16.08,24.84 v21.87,24.84 v21.87,17.83 | v14.86,34.75 14.86,25.98 16,24.84 v16,24.77

### Text on the board
tNames: V1.0